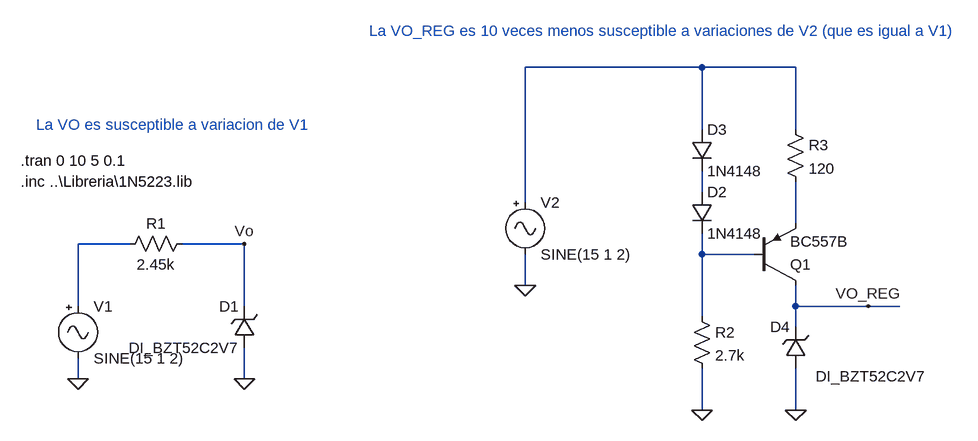
[diagram p0: schematic Test_Zener.asc]
Test_Zener.asc, the LTspice schematic file:
Version 4
SHEET 1 1532 680
WIRE 1008 -144 736 -144
WIRE 1152 -144 1008 -144
WIRE 1008 -48 1008 -144
WIRE 1152 -48 1152 -144
WIRE 1008 48 1008 16
WIRE 736 64 736 -144
WIRE 1152 96 1152 32
WIRE 128 128 48 128
WIRE 304 128 208 128
WIRE 1008 144 1008 112
WIRE 1088 144 1008 144
WIRE 736 192 736 144
WIRE 48 224 48 128
WIRE 304 224 304 128
WIRE 1152 224 1152 192
WIRE 1264 224 1152 224
WIRE 1312 224 1264 224
WIRE 1008 240 1008 144
WIRE 1152 256 1152 224
WIRE 48 336 48 304
WIRE 304 336 304 288
WIRE 1008 384 1008 320
WIRE 1152 384 1152 320
FLAG 304 336 0
FLAG 48 336 0
FLAG 304 128 Vo
FLAG 1008 384 0
FLAG 1152 384 0
FLAG 1264 224 VO_REG
FLAG 736 192 0
SYMBOL zener 320 288 R180
WINDOW 0 24 64 Left 2
WINDOW 3 24 0 Left 2
SYMATTR InstName D1
SYMATTR Value DI_BZT52C2V7
SYMATTR Prefix X
SYMBOL res 224 112 R90
WINDOW 0 0 56 VBottom 2
WINDOW 3 32 56 VTop 2
SYMATTR InstName R1
SYMATTR Value 2.45k
SYMBOL Misc\\signal 48 208 R0
WINDOW 123 0 0 Left 2
WINDOW 39 0 0 Left 2
SYMATTR InstName V1
SYMATTR Value SINE(15 1 2)
SYMBOL pnp 1088 192 M180
SYMATTR InstName Q1
SYMATTR Value BC557B
SYMBOL diode 992 48 R0
SYMATTR InstName D2
SYMATTR Value 1N4148
SYMBOL diode 992 -48 R0
SYMATTR InstName D3
SYMATTR Value 1N4148
SYMBOL zener 1168 320 R180
WINDOW 0 24 64 Left 2
WINDOW 3 -185 -12 Left 2
SYMATTR InstName D4
SYMATTR Value DI_BZT52C2V7
SYMATTR Prefix X
SYMBOL res 992 224 R0
SYMATTR InstName R2
SYMATTR Value 2.7k
SYMBOL res 1136 -64 R0
SYMATTR InstName R3
SYMATTR Value 120
SYMBOL Misc\\signal 736 48 R0
WINDOW 123 0 0 Left 2
WINDOW 39 0 0 Left 2
SYMATTR InstName V2
SYMATTR Value SINE(15 1 2)
TEXT -40 32 Left 2 !.inc ..\\Libreria\\1N5223.lib
TEXT -40 0 Left 2 !.tran 0 10 5 0.1
TEXT -16 -56 Left 2 ;La VO es susceptible a variacion de V1
TEXT 496 -200 Left 2 ;La VO_REG es 10 veces menos susceptible a variaciones de V2 (que es igual a V1)

The netlist it stands for:
* Test_Zener.asc
XD1 0 Vo DI_BZT52C2V7  ; pins + -
R1 Vo N004 2.45k
V1 N004 0 SINE(15 1 2)
Q1 VO_REG N005 N003 0 BC557B
D2 N002 N005 1N4148
D3 N001 N002 1N4148
XD4 0 VO_REG DI_BZT52C2V7  ; pins + -
R2 N005 0 2.7k
R3 N001 N003 120
V2 N001 0 SINE(15 1 2)
.model D D
.lib standard.dio
.model NPN NPN
.model PNP PNP
.lib standard.bjt
.inc ..\Libreria\1N5223.lib
.tran 0 10 5 0.1
* La VO es susceptible a variacion de V1
* La VO_REG es 10 veces menos susceptible a variaciones de V2 (que es igual a V1)
.backanno
.end